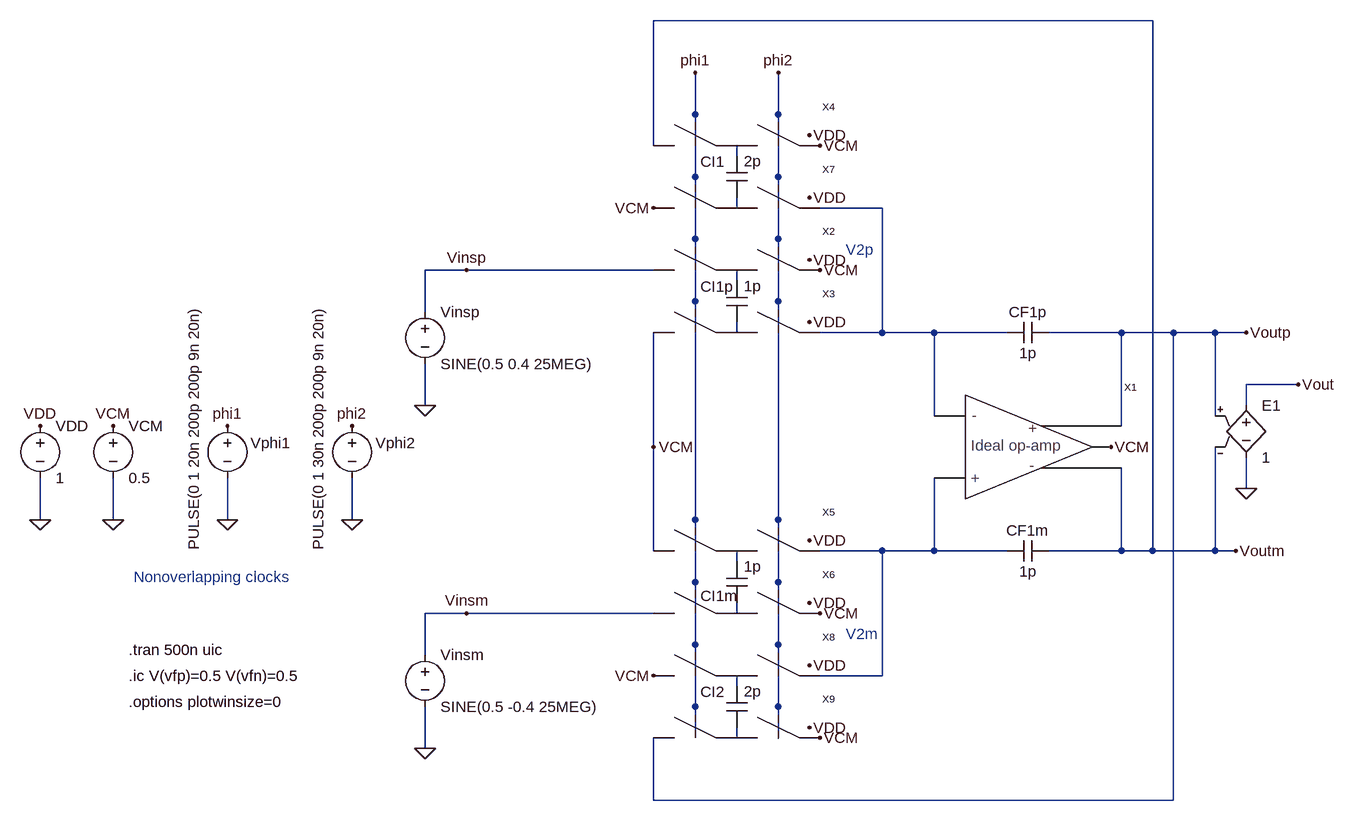
[diagram p0: schematic _Fig8_11_MSD.asc]
_Fig8_11_MSD.asc, the LTspice schematic file:
Version 4
SHEET 1 3176 696
WIRE 1632 -768 864 -768
WIRE 928 -624 928 -688
WIRE 1056 -624 1056 -688
WIRE 864 -576 864 -768
WIRE 992 -560 992 -576
WIRE 928 -528 928 -624
WIRE 1056 -528 1056 -624
WIRE 992 -480 992 -496
WIRE 1216 -480 1120 -480
WIRE 928 -432 928 -528
WIRE 1056 -432 1056 -528
WIRE 576 -384 512 -384
WIRE 864 -384 576 -384
WIRE 992 -368 992 -384
WIRE 928 -336 928 -432
WIRE 1056 -336 1056 -432
WIRE 512 -320 512 -384
WIRE 992 -288 992 -304
WIRE 1216 -288 1216 -480
WIRE 1216 -288 1120 -288
WIRE 1296 -288 1216 -288
WIRE 1408 -288 1296 -288
WIRE 1584 -288 1472 -288
WIRE 1664 -288 1584 -288
WIRE 1728 -288 1664 -288
WIRE 1776 -288 1728 -288
WIRE 1856 -208 1776 -208
WIRE 512 -176 512 -240
WIRE 1776 -176 1776 -208
WIRE 1296 -160 1296 -288
WIRE 1728 -160 1728 -288
WIRE 1584 -144 1584 -288
WIRE 864 -112 864 -288
WIRE 1776 -48 1776 -96
WIRE -80 0 -80 -64
WIRE 32 0 32 -64
WIRE 208 0 208 -64
WIRE 400 0 400 -64
WIRE 928 0 928 -336
WIRE 1056 0 1056 -336
WIRE 864 48 864 -112
WIRE 1216 48 1120 48
WIRE 1296 48 1296 -64
WIRE 1296 48 1216 48
WIRE 1408 48 1296 48
WIRE 1584 48 1584 -80
WIRE 1584 48 1472 48
WIRE 1632 48 1632 -768
WIRE 1632 48 1584 48
WIRE 1728 48 1728 -112
WIRE 1728 48 1632 48
WIRE 1760 48 1728 48
WIRE 992 64 992 48
WIRE 928 96 928 0
WIRE 1056 96 1056 0
WIRE 576 144 512 144
WIRE 864 144 576 144
WIRE 992 144 992 128
WIRE 928 192 928 96
WIRE 1056 192 1056 96
WIRE 512 208 512 144
WIRE 1216 240 1216 48
WIRE 1216 240 1120 240
WIRE 992 256 992 240
WIRE 928 288 928 192
WIRE 1056 288 1056 192
WIRE 928 336 928 288
WIRE 992 336 992 320
WIRE 1056 336 1056 288
WIRE 512 352 512 288
WIRE 864 432 864 336
WIRE 1664 432 1664 -288
WIRE 1664 432 864 432
FLAG 512 -176 0
FLAG 576 -384 Vinsp
FLAG -80 0 0
FLAG -80 -144 VDD
FLAG 1104 -400 VDD
FLAG 1104 -304 VDD
FLAG 1568 -112 VCM
FLAG 864 -112 VCM
FLAG 32 0 0
FLAG 32 -144 VCM
FLAG 1776 -288 Voutp
FLAG 1104 32 VDD
FLAG 1104 128 VDD
FLAG 512 352 0
FLAG 576 144 Vinsm
FLAG 1760 48 Voutm
FLAG 1120 -384 VCM
FLAG 1120 144 VCM
FLAG 1104 -592 VDD
FLAG 1104 -496 VDD
FLAG 928 -688 phi1
FLAG 1056 -688 phi2
FLAG 1120 -576 VCM
FLAG 1104 224 VDD
FLAG 1104 320 VDD
FLAG 1120 336 VCM
FLAG 864 240 VCM
FLAG 864 -480 VCM
FLAG 1776 -48 0
FLAG 1856 -208 Vout
FLAG 208 0 0
FLAG 208 -144 phi1
FLAG 400 0 0
FLAG 400 -144 phi2
SYMBOL voltage 512 -336 R0
WINDOW 123 0 0 Left 0
WINDOW 39 0 0 Left 0
SYMATTR InstName Vinsp
SYMATTR Value SINE(0.5 0.4 25MEG)
SYMBOL voltage -80 -160 R0
WINDOW 123 0 0 Left 0
WINDOW 39 0 0 Left 0
SYMATTR InstName VDD
SYMATTR Value 1
SYMBOL switches_2 864 -368 R0
SYMATTR InstName X2
SYMBOL switches_2 864 -272 R0
SYMATTR InstName X3
SYMBOL cap 1408 -272 R270
WINDOW 0 32 32 VTop 0
WINDOW 3 0 32 VBottom 0
SYMATTR InstName CF1p
SYMATTR Value 1p
SYMBOL cap 976 -368 R0
WINDOW 0 -40 9 Left 0
WINDOW 3 27 8 Left 0
SYMATTR InstName CI1p
SYMATTR Value 1p
SYMBOL voltage 32 -160 R0
WINDOW 123 0 0 Left 0
WINDOW 39 0 0 Left 0
SYMATTR InstName VCM
SYMATTR Value 0.5
SYMBOL Ideal_differential_op_amp 1344 -112 R0
SYMATTR InstName X1
SYMBOL cap 1472 32 R90
WINDOW 0 0 32 VBottom 0
WINDOW 3 32 32 VTop 0
SYMATTR InstName CF1m
SYMATTR Value 1p
SYMBOL switches_2 864 64 R0
SYMATTR InstName X5
SYMBOL switches_2 864 160 R0
SYMATTR InstName X6
SYMBOL cap 976 64 R0
WINDOW 0 -40 53 Left 0
WINDOW 3 27 8 Left 0
SYMATTR InstName CI1m
SYMATTR Value 1p
SYMBOL voltage 512 192 R0
WINDOW 123 0 0 Left 0
WINDOW 39 0 0 Left 0
SYMATTR InstName Vinsm
SYMATTR Value SINE(0.5 -0.4 25MEG)
SYMBOL switches_2 864 -560 R0
SYMATTR InstName X4
SYMBOL switches_2 864 -464 R0
SYMATTR InstName X7
SYMBOL cap 976 -560 R0
WINDOW 0 -40 9 Left 0
WINDOW 3 27 8 Left 0
SYMATTR InstName CI1
SYMATTR Value 2p
SYMBOL switches_2 864 256 R0
SYMATTR InstName X8
SYMBOL switches_2 864 352 R0
SYMATTR InstName X9
SYMBOL cap 976 256 R0
WINDOW 0 -40 9 Left 0
WINDOW 3 27 8 Left 0
SYMATTR InstName CI2
SYMATTR Value 2p
SYMBOL e 1776 -192 R0
SYMATTR InstName E1
SYMATTR Value 1
SYMBOL voltage 208 -160 R0
WINDOW 0 36 42 Left 0
WINDOW 3 -52 207 VLeft 0
WINDOW 123 0 0 Left 0
WINDOW 39 0 0 Left 0
SYMATTR InstName Vphi1
SYMATTR Value PULSE(0 1 20n 200p 200p 9n 20n)
SYMBOL voltage 400 -160 R0
WINDOW 0 36 42 Left 0
WINDOW 3 -52 207 VLeft 0
WINDOW 123 0 0 Left 0
WINDOW 39 0 0 Left 0
SYMATTR InstName Vphi2
SYMATTR Value PULSE(0 1 30n 200p 200p 9n 20n)
TEXT 56 200 Left 0 !.tran 500n uic
TEXT 64 88 Left 0 ;Nonoverlapping clocks
TEXT 56 240 Left 0 !.ic V(vfp)=0.5 V(vfn)=0.5
TEXT 56 280 Left 0 !.options plotwinsize=0
TEXT 1160 -416 Left 0 ;V2p
TEXT 1160 176 Left 0 ;V2m

The netlist it stands for:
* _Fig8_11_MSD.asc
Vinsp Vinsp 0 SINE(0.5 0.4 25MEG)
VDD VDD 0 1
XX2 Vinsp phi1 phi2 VCM VDD N004 switches_2  ; pins P1 clk1 Clk2 P3 VDD P2
XX3 VCM phi1 phi2 N003 VDD N005 switches_2  ; pins P1 clk1 Clk2 P3 VDD P2
CF1p N003 Voutp 1p
CI1p N004 N005 1p
VCM VCM 0 0.5
XX1 N003 N006 Voutp VCM Voutm Ideal_differential_op_amp  ; pins Vinm Vinp Outp VCM Outm
CF1m Voutm N006 1p
XX5 VCM phi1 phi2 N006 VDD N007 switches_2  ; pins P1 clk1 Clk2 P3 VDD P2
XX6 Vinsm phi1 phi2 VCM VDD N008 switches_2  ; pins P1 clk1 Clk2 P3 VDD P2
CI1m N007 N008 1p
Vinsm Vinsm 0 SINE(0.5 -0.4 25MEG)
XX4 Voutm phi1 phi2 VCM VDD N001 switches_2  ; pins P1 clk1 Clk2 P3 VDD P2
XX7 VCM phi1 phi2 N003 VDD N002 switches_2  ; pins P1 clk1 Clk2 P3 VDD P2
CI1 N001 N002 2p
XX8 VCM phi1 phi2 N006 VDD N009 switches_2  ; pins P1 clk1 Clk2 P3 VDD P2
XX9 Voutp phi1 phi2 VCM VDD N010 switches_2  ; pins P1 clk1 Clk2 P3 VDD P2
CI2 N009 N010 2p
E1 Vout 0 Voutp Voutm 1
Vphi1 phi1 0 PULSE(0 1 20n 200p 200p 9n 20n)
Vphi2 phi2 0 PULSE(0 1 30n 200p 200p 9n 20n)
.tran 500n uic
* Nonoverlapping clocks
.ic V(vfp)=0.5 V(vfn)=0.5
.options plotwinsize=0
* V2p
* V2m
.backanno
.end